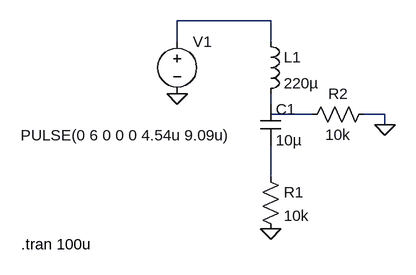
[diagram p0: schematic Draft2.asc]
Draft2.asc, the LTspice schematic file:
Version 4.1
SHEET 1 880 680
WIRE 240 64 96 64
WIRE 96 96 96 64
WIRE 240 96 240 64
WIRE 240 192 240 176
WIRE 304 208 240 208
WIRE 416 208 384 208
WIRE 416 224 416 208
WIRE 240 304 240 256
FLAG 96 176 0
FLAG 240 384 0
FLAG 416 224 0
SYMBOL voltage 96 80 R0
WINDOW 3 -241 160 Left 2
WINDOW 123 0 0 Left 0
WINDOW 39 0 0 Left 0
SYMATTR InstName V1
SYMATTR Value PULSE(0 6 0 0 0 4.54u 9.09u)
SYMBOL ind 224 80 R0
SYMATTR InstName L1
SYMATTR Value 220µ
SYMBOL cap 224 192 R0
SYMATTR InstName C1
SYMATTR Value 10µ
SYMBOL res 224 288 R0
SYMATTR InstName R1
SYMATTR Value 10k
SYMBOL res 400 192 R90
WINDOW 0 0 56 VBottom 2
WINDOW 3 32 56 VTop 2
SYMATTR InstName R2
SYMATTR Value 10k
TEXT -144 408 Left 2 !.tran 100u

The netlist it stands for:
* Draft2.asc
V1 N001 0 PULSE(0 6 0 0 0 4.54u 9.09u)
L1 N001 N002 220µ
C1 N002 N004 10µ
R1 N004 0 10k
R2 0 N003 10k
.tran 100u
.backanno
.end